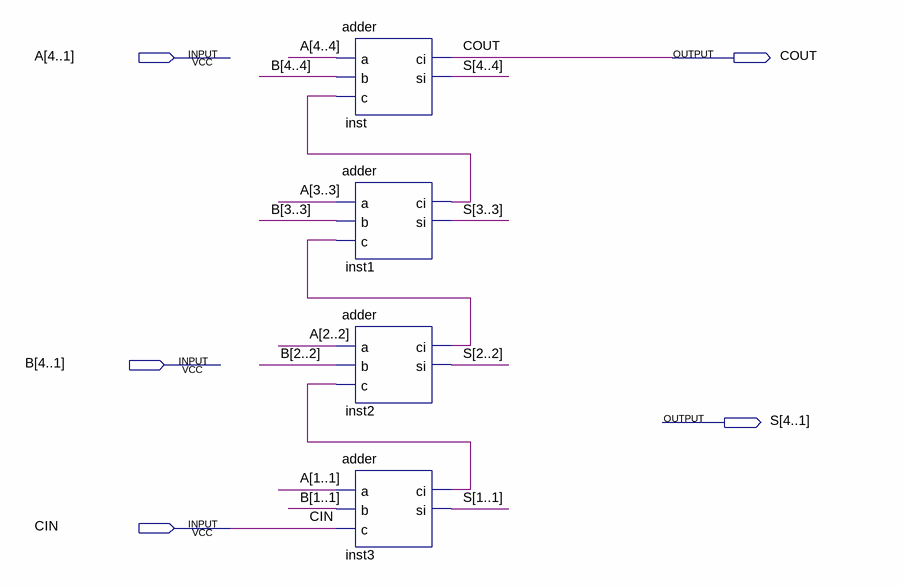
[diagram p0: schematic sheet]
// Quartus schematic jfq.bdf as structural Verilog: 4 symbols, 5 pins
module jfq (
  input  [4:1] A,
  input  [4:1] B,
  input  CIN,
  output COUT,
  output [4:1] S
);

  wire inst1_ci, inst2_ci, inst3_ci;

  adder inst (.a(A[4]), .b(B[4]), .c(inst1_ci), .ci(COUT), .si(S[4]));
  adder inst1 (.a(A[3]), .b(B[3]), .c(inst2_ci), .ci(inst1_ci), .si(S[3]));
  adder inst2 (.a(A[2]), .b(B[2]), .c(inst3_ci), .ci(inst2_ci), .si(S[2]));
  adder inst3 (.a(A[1]), .b(B[1]), .c(CIN), .ci(inst3_ci), .si(S[1]));
endmodule
